# EAGLE design FliegerPCB10 (EAGLE 9.6.0)
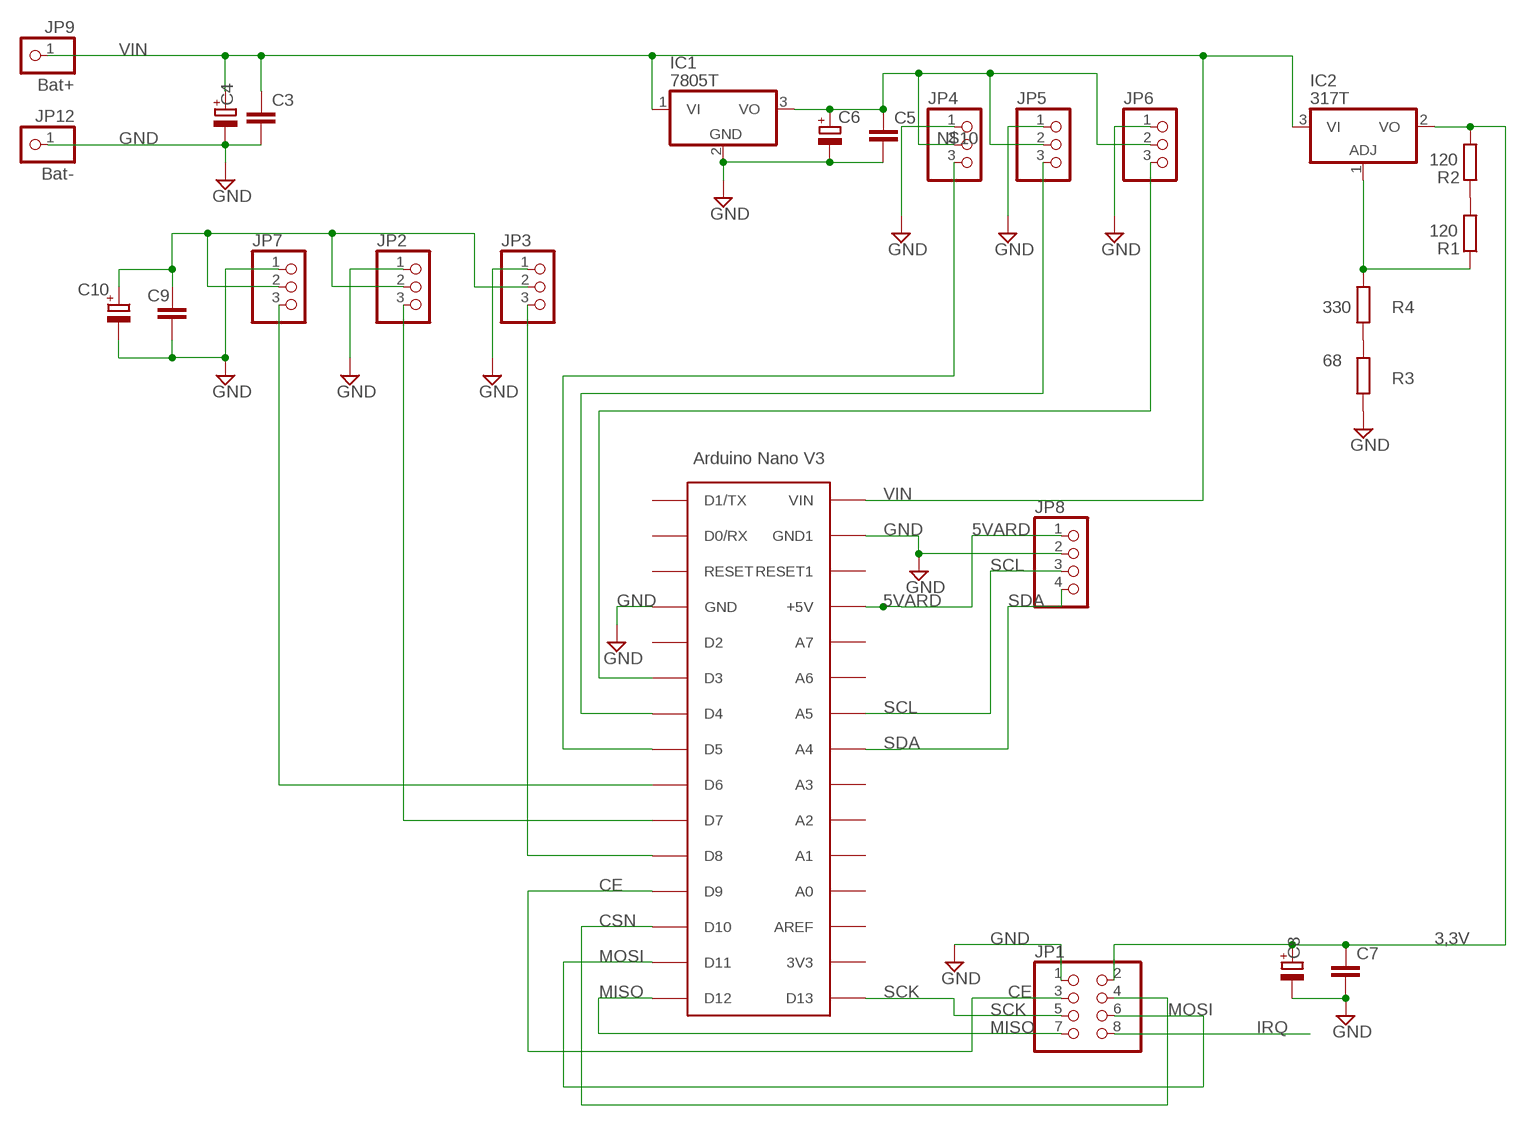
[diagram p0: schematic, sheet 1]

## Parts
C3  C-EU050-024X044  [C050-024X044]
C4  CPOL-EUE5-10.5  [E5-10,5]
C5  C-EU050-024X044  [C050-024X044]
C6  CPOL-EUE5-10.5  [E5-10,5]
C7  C-EU050-024X044  [C050-024X044]
C8  CPOL-EUE3.5-8  [E3,5-8]
C9  C-EU050-024X044  [C050-024X044]
C10  CPOL-EUE5-10.5  [E5-10,5]
IC1  7805T  [TO220H]
IC2  317T  [TO220H]
JP1  PINHD-2X4  [2X04]
JP2  PINHD-1X3  [1X03]
JP3  PINHD-1X3  [1X03]
JP4  PINHD-1X3  [1X03]
JP5  PINHD-1X3  [1X03]
JP6  PINHD-1X3  [1X03]
JP7  PINHD-1X3  [1X03]
JP8  PINHD-1X4  [1X04]
JP9  Bat+  PINHD-1X1  [1X01]
JP12  Bat-  PINHD-1X1  [1X01]
R1  120  R-EU_0207/10  [0207/10]
R2  120  R-EU_0207/10  [0207/10]
R3  68  R-EU_0207/10  [0207/10]
R4  330  R-EU_0207/10  [0207/10]
U$1  ARDUINONANO  [PDIP-32]

## Nets
3,3V: C7.1 C8.+ IC2.2(VO) JP1.2 R2.2
5VARD: JP8.1 U$1.+5V
CE: JP1.3 U$1.D9
CSN: JP1.4 U$1.D10
GND: C3.2 C4.- C5.2 C6.- C7.2 C8.- C9.2 C10.- IC1.2(GND) JP1.1 JP2.1 JP3.1 JP4.1 JP5.1 JP6.1 JP7.1 JP8.2 JP12.1 R3.2 U$1.GND U$1.GND1
IRQ: JP1.8
MISO: JP1.7 U$1.D12
MOSI: JP1.6 U$1.D11
N$1: JP7.3 U$1.D6
N$2: JP2.3 U$1.D7
N$3: JP3.3 U$1.D8
N$4: JP4.3 U$1.D5
N$5: JP5.3 U$1.D4
N$6: JP6.3 U$1.D3
N$7: R1.2 R2.1
N$8: IC2.1(ADJ) R1.1 R4.1
N$9: R3.1 R4.2
N$10: C5.1 C6.+ IC1.3(VO) JP4.2 JP5.2 JP6.2
N$11: C9.1 C10.+ JP2.2 JP3.2 JP7.2
SCK: JP1.5 U$1.D13
SCL: JP8.3 U$1.A2(A5)
SDA: JP8.4 U$1.A3(A4)
VIN: C3.1 C4.+ IC1.1(VI) IC2.3(VI) JP9.1 U$1.VIN
Unconnected: U$1.3V3 U$1.A0(A7) U$1.A1(A6) U$1.A4(A3) U$1.A5(A2) U$1.A6(A1) U$1.A7(A0) U$1.AREF U$1.D0/RX U$1.D1/TX U$1.D2 U$1.RESET U$1.RESET1

## Library data of the parts
C3 C5 C7 C9 = rcl:C-EU: CAPACITOR, European symbol; SPICEPREFIX: C
C4 C6 C8 C10 = rcl:CPOL-EU: POLARIZED CAPACITOR, European symbol; SPICEPREFIX: C
IC1 = linear:78*: Positive VOLTAGE REGULATOR Source: http://cache.national.com/ds/LM/LM78L05.pdf http://www.fairchildsemi.com/ds/LM/LM7805.pdf
IC2 = linear:*317: Positive VOLTAGE REGULATOR
JP1 = pinhead:PINHD-2X4: PIN HEADER
JP2-JP7 = pinhead:PINHD-1X3: PIN HEADER
JP8 = pinhead:PINHD-1X4: PIN HEADER
JP9 JP12 = pinhead:PINHD-1X1: PIN HEADER
R1-R4 = rcl:R-EU_: RESISTOR, European symbol; SPICEPREFIX: R
U$1 = CRE-Lib1:ARDUINONANO: Arduino Nano

## Board
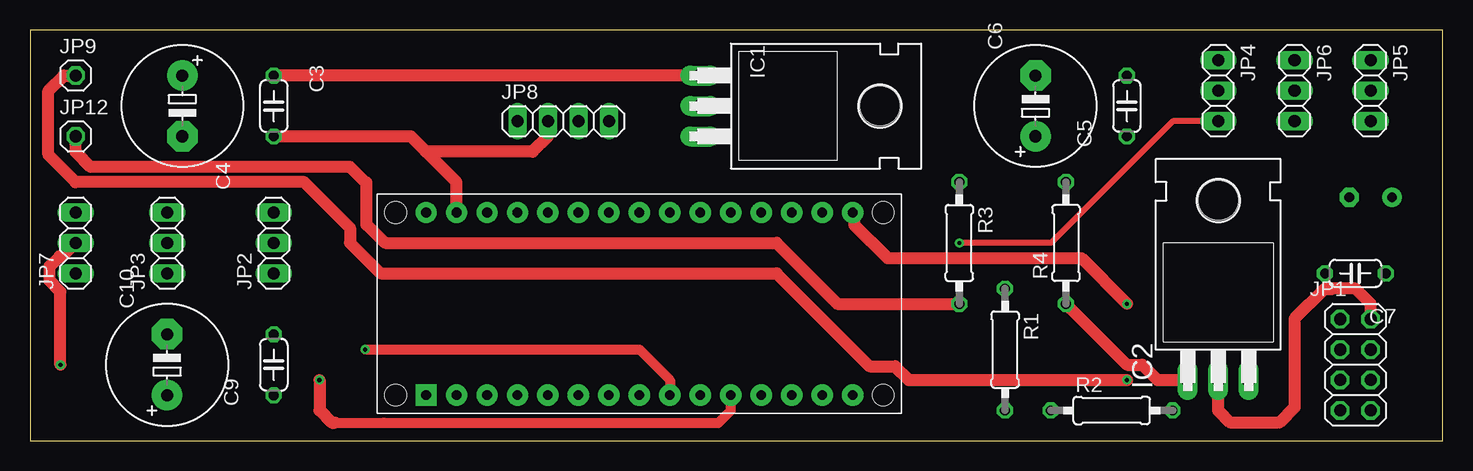
[diagram p1: board, top side]
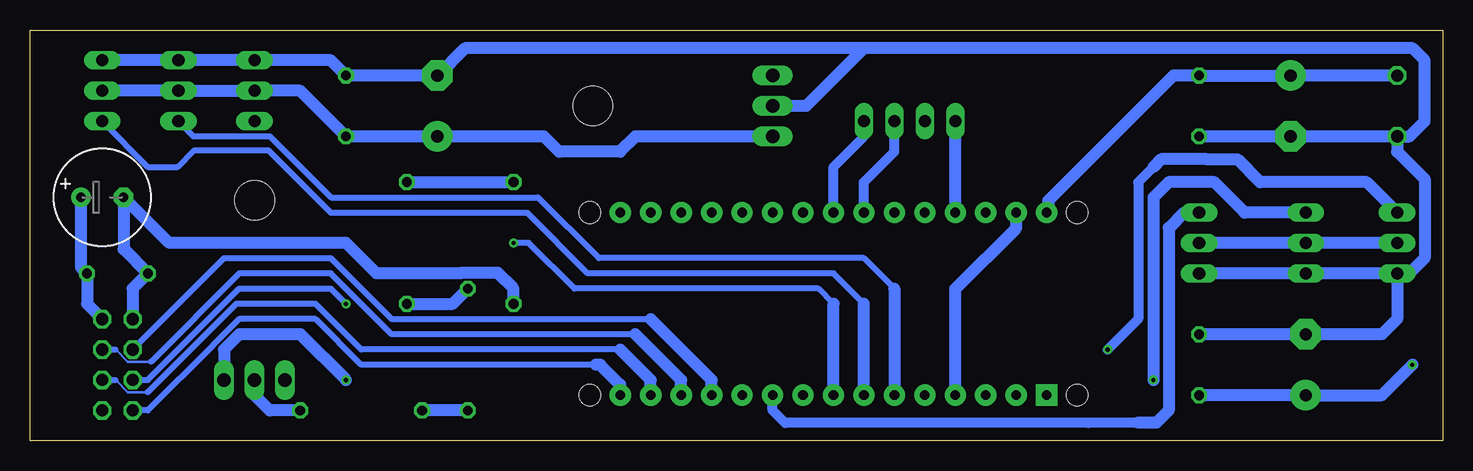
[diagram p2: board, bottom side, seen from below]

Size 117.78 x 34.28 mm. Coordinates in mm from the lower left corner, seen from the top.
Outline: 0,0 117.78,0 117.78,34.28 0,34.28 0,0
Copper layers (1*16): Top 0.035mm / dielectric 1.5mm / Bottom 0.035mm
Design rules "default": minimum track width 6mil, minimum drill 0.35mm, track to track 6mil, track to pad 6mil, pad to pad 6mil, via to via 6mil, smd to smd 6mil, copper to edge 40mil, drill to drill 6mil, minimum pad ring 10mil, minimum via ring 8mil, stop-mask expansion 4mil, vias tented up to drill 0mil, thermal gap 10mil

### Footprints (pad centres in the part's own frame; a part is rotated, then mirrored left to right if it is on the bottom)
C050-024X044 = drill 0.813 octagon: 1 -2.54,0; 2 2.54,0
E5-10,5 = drill 1.016 pad 2.54: + -2.54,0 | drill 1.016 pad 2.54 octagon: - 2.54,0
E3,5-8 = drill 0.813 pad 1.6: + -1.778,0 | drill 0.813 pad 1.6 octagon: - 1.778,0
TO220H = drill 1.118 long: 1 -2.54,-10.16; 2 0,-10.16; 3 2.54,-10.16 | hole 3.302: 0,4.826
2X04 = drill 1.016 octagon: 1 -3.81,-1.27; 2 -3.81,1.27; 3 -1.27,-1.27; 4 -1.27,1.27; 5 1.27,-1.27; 6 1.27,1.27; 7 3.81,-1.27; 8 3.81,1.27
1X03 = drill 1.016 long: 1 -2.54,0; 2 0,0; 3 2.54,0
1X04 = drill 1.016 long: 1 -3.81,0; 2 -1.27,0; 3 1.27,0; 4 3.81,0
1X01 = drill 1.016 octagon: 1 0,0
0207/10 = drill 0.813 octagon: 1 -5.08,0; 2 5.08,0
PDIP-32 = drill 0.8 pad 1.778: 3V3 15.24,-35.56; +5V 15.24,-10.16; A0 15.24,-12.7; A1 15.24,-15.24; A2 15.24,-17.78; A3 15.24,-20.32; A4 15.24,-22.86; A5 15.24,-25.4; A6 15.24,-27.94; A7 15.24,-30.48; AREF 15.24,-33.02; D0/RX 0,-5.08; D2 0,-12.7; D3 0,-15.24; D4 0,-17.78; D5 0,-20.32; D6 0,-22.86; D7 0,-25.4; D8 0,-27.94; D9 0,-30.48; D10 0,-33.02; D11 0,-35.56; D12 0,-38.1; D13 15.24,-38.1; GND 0,-10.16; GND1 15.24,-5.08; RESET 0,-7.62; RESET1 15.24,-7.62; VIN 15.24,-2.54 | drill 0.8 pad 1.778 square: D1/TX 0,-2.54 | hole 1.778: 0,0; 0,-40.64; 15.24,-40.64; 15.24,0

### Placement (x,y rotation side)
C3  20.32,27.94 270 top
C4  12.7,27.94 270 top
C5  91.44,27.94 90 top
C6  83.82,27.94 90 top
C7  110.49,13.97 180 top
C8  111.76,20.32 0 bottom
C9  20.32,6.35 90 top
C10  11.43,6.35 90 top
IC1  66.04,27.94 270 top
IC2  99.06,15.24 0 top
JP1  110.49,6.35 270 top
JP2  20.32,16.51 90 top
JP3  11.43,16.51 90 top
JP4  99.06,29.21 270 top
JP5  111.76,29.21 270 top
JP6  105.41,29.21 270 top
JP7  3.81,16.51 90 top
JP8  44.45,26.67 0 top
JP9  3.81,30.48 0 top
JP12  3.81,25.4 0 top
R1  81.28,7.62 270 top
R2  90.17,2.54 0 top
R3  77.47,16.51 270 top
R4  86.36,16.51 90 top
U$1  30.48,3.81 90 top

### Tracks (layer width: path | path; a pad name or v marks a point on that pad's centre or on a via)
3,3V
  Top 1.016: JP1.2 111.76,11.43 110.49,12.7 108.55,12.7 108.5,12.65 107.9,12.65 105.41,10.16 105.41,2.79 104.14,1.52 100.08,1.52 99.06,2.54 IC2.2
  Bottom 1.016: R2.2 97.79,2.54 99.06,3.81 IC2.2 | C8.+ 113.54,14.48 C7.1 113.03,11.43 JP1.2
5VARD
  Bottom 1.016: U$1.+5V JP8.1
CE
  Bottom 0.508: JP1.3 101.6,15.24 92.71,15.24 87.63,10.16 66.04,10.16
  Bottom 1.016: U$1.D9 60.96,5.08 66.04,10.16
CSN
  Bottom 0.2: 110.66,7.62 109.64,6.61 107.69,6.61
  Bottom 0.508: 67.31,8.89 87.63,8.89 92.71,13.97 100.33,13.97 107.69,6.61 | JP1.4 110.66,7.62
  Bottom 1.016: U$1.D10 63.5,5.08 67.31,8.89
GND
  Top 1.016: JP12.1 3.81,24.13 5.08,22.86 26.67,22.86 27.94,21.59 28.05,21.59 28.05,18.05 28.07,18.05 29.61,16.51 62.23,16.51 67.31,11.43 R3.2 | U$1.GND1 35.56,21.59 33.02,24.13 | 33.02,24.13 31.75,25.4 C3.2 | JP8.2 43.18,25.4 41.91,24.13 33.02,24.13
  Bottom 1.016: JP12.1 C4.- C3.2 | JP12.1 3.81,24.13 1.52,21.84 1.52,15.24 2.79,13.97 JP7.1 | JP7.1 JP3.1 JP2.1 | JP12.1 2.79,25.4 1.52,26.67 1.52,31.75 2.53,32.76 48.26,32.76 | JP7.1 3.81,10.16 5.08,8.89 C10.- C9.2 | 48.26,32.76 53.08,27.94 IC1.2 | 48.26,32.76 81.54,32.76 C6.- C5.2 92.71,31.75 JP4.1 JP6.1 JP5.1 | JP1.1 109.22,12.7 C7.2 109.98,16 C8.- 106.17,16.51 91.44,16.51 88.9,13.97 81.88,13.97 81.83,14.02 78.79,14.02 77.47,12.7 R3.2 | U$1.GND1 35.56,17.78 40.64,12.7 U$1.GND
MISO
  Bottom 0.508: 70.61,6.35 90.17,6.35 93.98,10.16 100.35,10.16 102.51,8 102.51,7.98 107.95,2.54 JP1.7
  Bottom 1.016: U$1.D12 68.58,4.68 70.25,6.35 70.61,6.35
MOSI
  Bottom 0.2: 110.66,5.08 109.64,4.07 108,4.07
  Bottom 0.508: 108,4.07 107.95,4.07 100.59,11.43 93.98,11.43 90.17,7.62 68.58,7.62 | JP1.6 110.66,5.08
  Bottom 1.016: U$1.D11 66.04,5.08 68.58,7.62
N$1  (via drill 0.35)
  Top 0.813: U$1.D6 53.34,5.08 50.8,7.62 v27.94,7.62
  Bottom 0.813: 24.13,22.86 25.4,21.59 25.4,10.16 v27.94,7.62
  Bottom 1.016: JP7.3 6.35,21.59 15.24,21.59 17.14,23.5 19.68,23.5 23.5,23.5 24.13,22.86
N$2
  Bottom 0.813: 25.4,1.52 29.5,1.52 29.52,1.5 54.84,1.5 55.88,2.54 U$1.D7
  Bottom 1.016: JP2.3 21.59,19.05 22.86,17.78 22.86,2.54 23.88,1.52 25.4,1.52
N$3  (via drill 0.35)
  Top 0.813: 25.4,1.52 29.5,1.52 29.52,1.5 57.38,1.5 58.42,2.54 U$1.D8
  Top 1.016: v24.13,5.08 24.13,2.54 25.15,1.52 25.4,1.52
  Bottom 1.016: JP3.3 16.51,19.05 19.05,21.59 22.86,21.59 24.13,20.32 v24.13,5.08
N$4  (via drill 0.35)
  Top 0.508: JP4.3 95.25,26.67 85.09,16.51 v77.47,16.51
  Bottom 0.508: 50.8,11.43 52.07,12.7 72.39,12.7 76.2,16.51 v77.47,16.51
  Bottom 1.016: U$1.D5 50.8,11.43
N$5
  Bottom 0.508: JP5.3 107.95,22.86 105.48,22.86 104.08,24.26 97.92,24.26 92.71,19.05 76.36,19.05 71.28,13.97 50.8,13.97 48.26,11.43
  Bottom 1.016: U$1.D4 48.26,11.43
N$6
  Bottom 0.508: 45.72,12.7 48.26,15.24 70.36,15.24 75.44,20.32 92.69,20.32 97.79,25.43 104.17,25.43 JP6.3
  Bottom 1.016: 45.72,12.7 U$1.D3
N$7
  Bottom 1.016: R1.2 R2.1
N$8
  Top 1.016: R4.1 91.44,6.35 92.71,6.35 93.98,5.08 IC2.1
  Bottom 1.016: R4.1 82.55,11.43 R1.1
N$9
  Bottom 1.016: R4.2 R3.1
N$10
  Bottom 1.016: JP5.2 JP6.2 JP4.2 95.25,29.21 C5.1 C6.+ 74.93,25.4 73.66,24.13 68.58,24.13 67.31,25.4 66.04,25.4 IC1.3
N$11  (via drill 0.35)
  Top 1.016: JP7.2 2.69,15.39 2.46,15.39 1.63,14.56 1.63,13.38 2.54,12.47 v2.54,6.35
  Bottom 1.016: JP7.2 JP3.2 JP2.2 | C9.1 C10.+ 5.08,3.81 v2.54,6.35
SCK  (via drill 0.35)
  Top 1.016: U$1.D13 68.71,18.92 68.71,18.05 71.52,15.24 87.63,15.24 v91.44,11.43
  Bottom 0.508: JP1.5 107.95,5.08 100.33,12.7 92.71,12.7 v91.44,11.43
SCL
  Bottom 0.813: U$1.A2 48.26,21.59 46.99,22.86 45.72,24.13 JP8.3
SDA
  Bottom 0.813: U$1.A3 50.8,22.86 48.26,25.4 JP8.4
VIN  (via drill 0.35)
  Top 1.016: JP9.1 2.79,30.48 1.52,29.21 1.52,23.88 3.81,21.59 22.86,21.59 26.67,17.78 26.67,16.51 29.21,13.97 62.23,13.97 69.98,6.22 72.12,6.22 73.26,5.08 v91.44,5.08 | IC1.1 C3.1
  Bottom 1.016: JP9.1 C4.+ C3.1 22.46,30.48 32.89,20.05 32.89,19.18 U$1.VIN | v91.44,5.08 95.25,8.89 100.33,8.89 101.6,7.62 IC2.3